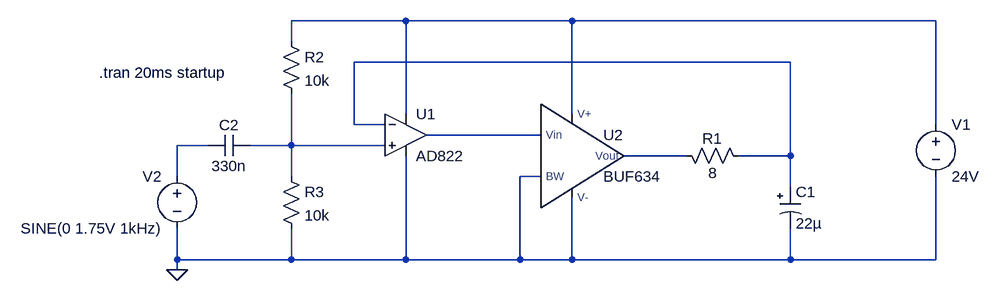
[diagram p0: schematic BUF634-jig.asc]
BUF634-jig.asc, the LTspice schematic file:
Version 4
SHEET 1 1000 680
WIRE 112 -80 -64 -80
WIRE 368 -80 112 -80
WIRE 928 -80 368 -80
WIRE -64 -48 -64 -80
WIRE 704 -16 32 -16
WIRE 112 64 112 -80
WIRE 368 64 368 -80
WIRE 32 80 32 -16
WIRE 80 80 32 80
WIRE 928 80 928 -80
WIRE 320 96 144 96
WIRE -192 112 -240 112
WIRE -64 112 -64 32
WIRE -64 112 -128 112
WIRE 80 112 -64 112
WIRE 544 128 448 128
WIRE 704 128 704 -16
WIRE 704 128 624 128
WIRE -240 160 -240 112
WIRE -64 160 -64 112
WIRE 320 160 288 160
WIRE 704 176 704 128
WIRE -240 288 -240 240
WIRE -64 288 -64 240
WIRE -64 288 -240 288
WIRE 112 288 112 128
WIRE 112 288 -64 288
WIRE 288 288 288 160
WIRE 288 288 112 288
WIRE 368 288 368 192
WIRE 368 288 288 288
WIRE 704 288 704 240
WIRE 704 288 368 288
WIRE 928 288 928 160
WIRE 928 288 704 288
WIRE -240 304 -240 288
FLAG -240 304 0
SYMBOL voltage 928 64 R0
WINDOW 123 0 0 Left 0
WINDOW 39 0 0 Left 0
SYMATTR InstName V1
SYMATTR Value 24V
SYMBOL res 528 112 M90
WINDOW 0 5 56 VBottom 2
WINDOW 3 27 56 VTop 2
SYMATTR InstName R1
SYMATTR Value 8
SYMBOL polcap 688 176 R0
WINDOW 3 24 56 Left 2
SYMATTR Value 22µ
SYMATTR InstName C1
SYMATTR Description Capacitor
SYMATTR Type cap
SYMATTR SpiceLine V=35 Irms=160m Rser=0.75 Lser=0 mfg="Nichicon" pn="UPL1V220MAH" type="Al electrolytic"
SYMBOL voltage -240 144 M0
WINDOW 123 0 0 Left 0
WINDOW 39 0 0 Left 0
SYMATTR InstName V2
SYMATTR Value SINE(0 1.75V 1kHz)
SYMBOL res -80 -64 R0
SYMATTR InstName R2
SYMATTR Value 10k
SYMBOL res -80 144 R0
SYMATTR InstName R3
SYMATTR Value 10k
SYMBOL cap -192 96 M90
WINDOW 0 0 32 VBottom 2
WINDOW 3 32 32 VTop 2
SYMATTR InstName C2
SYMATTR Value 330n
SYMBOL _PERSONAL\\opamps\\BUF634 352 128 R0
SYMATTR InstName U2
SYMATTR Description 200mA, 36V.  Used inside the feedback loop of standard OpAmps
SYMBOL Opamps\\AD822 112 32 R0
SYMATTR InstName U1
TEXT -360 0 Left 2 !.tran 20ms startup

The netlist it stands for:
* BUF634-jig.asc
V1 N001 0 24V
R1 N006 N002 8
C1 N002 0 22µ V=35 Irms=160m Rser=0.75 Lser=0 mfg="Nichicon" pn="UPL1V220MAH" type="Al electrolytic"
V2 N004 0 SINE(0 1.75V 1kHz)
R2 N001 N005 10k
R3 N005 0 10k
C2 N004 N005 330n
XU2 0 N003 0 N006 N001 BUF634  ; pins BW Vin V- Vout V+
XU1 N005 N002 N001 0 N003 AD822  ; pins In+ In- V+ V- OUT
.tran 20ms startup
.lib ..\sym\_PERSONAL\opamps\BUF634.sub
.backanno
.end